# Altium schematic sheet Relaymodule.SchDoc
size 250 x 250 mm; SheetNumber: 2; SheetTotal: 22
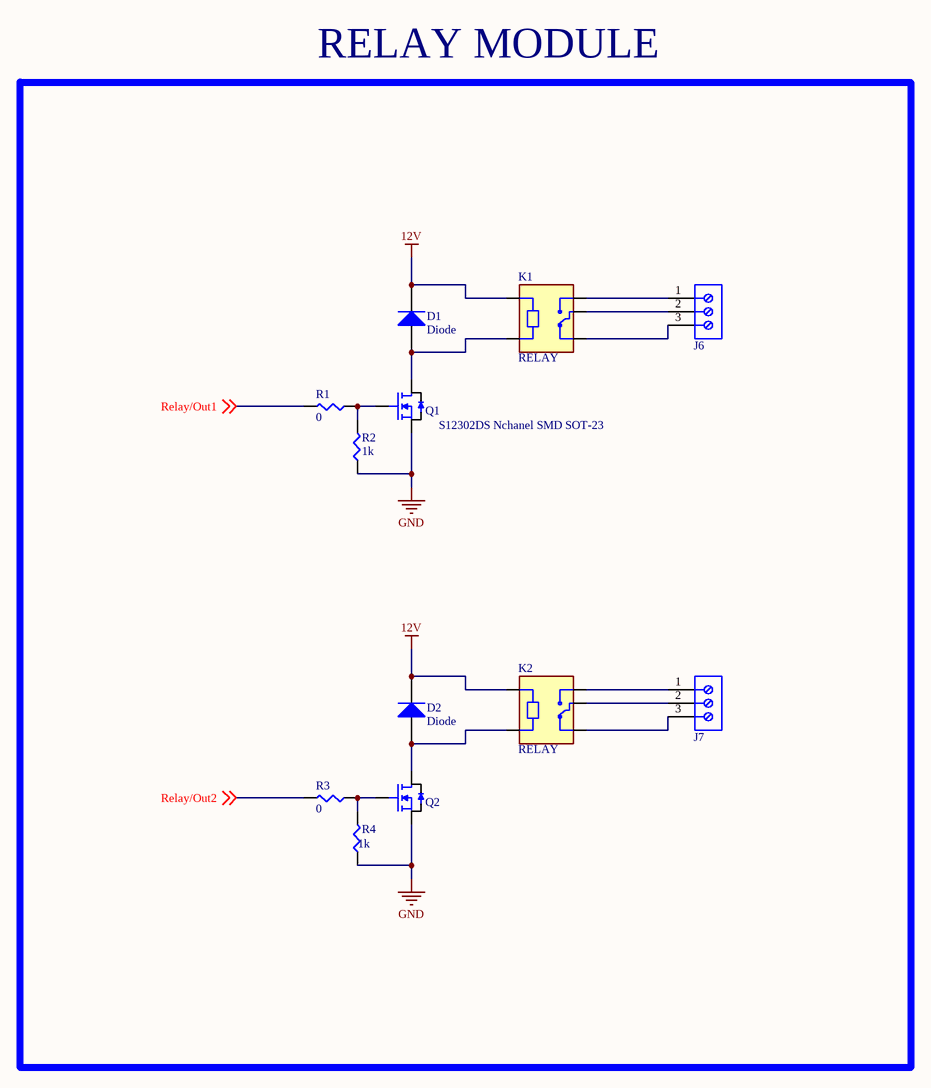
[diagram p0: Relaymodule.SchDoc]

## Parts
D1  Diode  [SMC]
D2  Diode  [SMC]
J6  691101710003  [691101710003]  (value not drawn)
J7  691101710003  [691101710003]  (value not drawn)
K1  RELAY  [RELAY]
K2  RELAY  [RELAY]
Q1  S12302DS Nchanel SMD SOT-23  [SOT-23-3N]
Q2  S12302DS Nchanel SMD SOT-23  [SOT-23-3N]  (value not drawn)
R1  0  [SMD-0805-RES]
R2  1k  [SMD-0805-RES]
R3  0  [SMD-0805-RES]
R4  1k  [SMD-0805-RES]

## Blocks framed on the sheet
RELAY MODULE: D1 D2 J6 J7 K1 K2 Q1 Q2 R1-R4

## Nets
12V: D1.2(K) D2.2(K) K1.A1 K2.A1
GND: Q1.2(Source) Q2.2(Source) R2.1 R4.1
Relay/Out1: R1.2 ; off-sheet Relay/Out1
Relay/Out2: R3.2 ; off-sheet Relay/Out2
NetD1_1: D1.1(A) K1.A2 Q1.3(Drain)
NetD2_1: D2.1(A) K2.A2 Q2.3(Drain)
NetJ6_1: J6.1 K1.NO
NetJ6_2: J6.2 K1.COM
NetJ6_3: J6.3 K1.NC
NetJ7_1: J7.1 K2.NO
NetJ7_2: J7.2 K2.COM
NetJ7_3: J7.3 K2.NC
NetQ1_1: Q1.1(Gate) R1.1 R2.2
NetQ2_1: Q2.1(Gate) R3.1 R4.2

## Library data of the parts
D1 D2 = Diode: Default Diode; Published: 8-Jun-2000; LatestRevisionDate: 17-Jul-2002; LatestRevisionNote: Re-released for DXP Platform.; PackageVersion: Sep-1996; PackageReference: SMC; Publisher: Altium Limited; PackageDescription: DO-214-AB/SMC; 2 C-Bend Leads; Body 7.9 x 5.9 mm, inc. leads (LxW); Code_JEDEC: DO-214-AB
J6 J7 = 691101710003: WR-TBL Series 101 Horizontal Entry Modular, THT, pitch 5mm, 3p; Manufacturer: Wurth Elektronik; Modularity: Yes; Rated Current: 16A; Working Voltage: 250V; ComponentLink1Description: Website Link; ComponentLink1URL: https://www.we-online.com/redexpert/article/691101710003?ad; ComponentLink2Description: Datasheet Link; ComponentLink2URL: https://www.we-online.com/redexpert/spec/691101710003?ad; Manufacturer Part Number: 691101710003; Category: Terminal Blocks; Match Code: WR-TBL; Mount: Through Hole; Operating Temperature Max: 105°C; Operating Temperature Min: -40°C; Packaging: Box; Application: Pressure Clamp; Number of Pins: 3; Number of Rows: 1; Orientation: Horizontal; Pitch: 5mm
Q1 Q2 = S12302DS: S12302DS Nchanel SMD SOT-23. VDS MAX 20. 400Ma DI
R1 R3 = ERJ-6ENF1001V: RES SMD 1K OHM 1% 1/8W 0805; Manufacturer: Panasonic Electronic Components; Unit Price (USD): 0.00729; @ qty: 1500; Minimum Quantity: 1; Power (Watts): 0.125W, 1/8W; Temperature Coefficient: ±100ppm/°C; Part Number: ERJ-6ENF1001V; Datasheets: http://industrial.panasonic.com/www-cgi/jvcr13pz.cgi?E+PZ+3+AOA0002+ERJ6ENF1001V+7+WW; Image: //media.digikey.com/Renders/Panasonic%20Renders/ERJ-0805%20Pkg.jpg; Digi-Key Part Number: P1.00KCCT-ND; Quantity Available: 12895103; Factory Stock: 0; Packaging: Cut Tape (CT); Series: ERJ; Part Status: Active; Value: 1k; Tolerance: ±1%; Composition: Thick Film; Features: Automotive AEC-Q200; Operating Temperature: -55°C ~ 155°C; Package / Case: 0805 (2012 Metric); Supplier Device Package: 0805; Size / Dimension: 0.079" L x 0.049" W (2.00mm x 1.25mm); Height - Seated (Max): 0.028" (0.70mm); Number of Terminations: 2; Failure Rate: -
R2 R4 = ERJ-6ENF1001V: RES SMD 1K OHM 1% 1/8W 0805; Manufacturer: Panasonic Electronic Components; Factory Stock: 0; Unit Price (USD): 0.00729; @ qty: 1500; Minimum Quantity: 1; Power (Watts): 0.125W, 1/8W; Temperature Coefficient: ±100ppm/°C; Part Number: ERJ-6ENF1001V; Datasheets: http://industrial.panasonic.com/www-cgi/jvcr13pz.cgi?E+PZ+3+AOA0002+ERJ6ENF1001V+7+WW; Image: //media.digikey.com/Renders/Panasonic%20Renders/ERJ-0805%20Pkg.jpg; Digi-Key Part Number: P1.00KCCT-ND; Quantity Available: 12895103; Packaging: Cut Tape (CT); Series: ERJ; Part Status: Active; Value: 1k; Tolerance: ±1%; Composition: Thick Film; Features: Automotive AEC-Q200; Operating Temperature: -55°C ~ 155°C; Package / Case: 0805 (2012 Metric); Supplier Device Package: 0805; Size / Dimension: 0.079" L x 0.049" W (2.00mm x 1.25mm); Height - Seated (Max): 0.028" (0.70mm); Number of Terminations: 2; Failure Rate: -